# Altium schematic sheet BufferOpAmp.SchDoc
size A4; CompanyName: Technische Hochschule Nürnberg Georg Simon Ohm; Organization: UltraZohm; Address1: Kesslerplatz 12; Address2: 90489 Nürnberg; Address3: GERMANY; DocumentNumber: 6; SheetNumber: 6; SheetTotal: 12; Website: www.ultrazohm.com
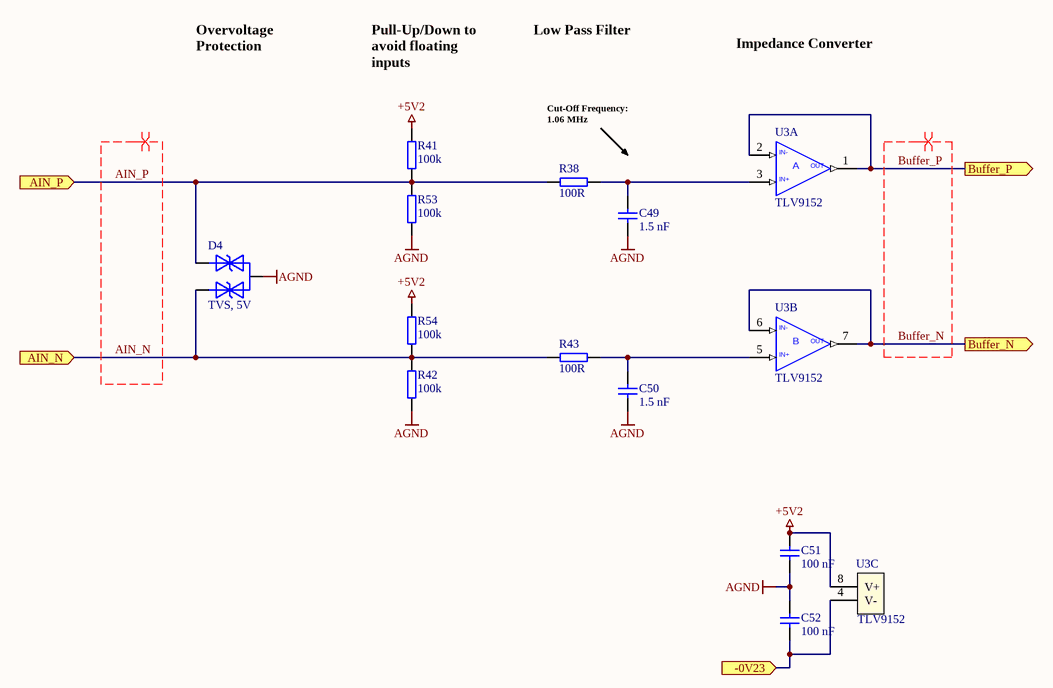
[diagram p0: BufferOpAmp.SchDoc]

## Parts
C49  1.5 nF  [C_0402_TE]
C50  1.5 nF  [C_0402_TE]
C51  100 nF  [C_0402_TE]
C52  100 nF  [C_0402_TE]
D4  TVS, 5V  [SOT-23-3]
R38  100R  [R_0402_TE]
R41  100k  [R_0402_TE]
R42  100k  [R_0402_TE]
R43  100R  [R_0402_TE]
R53  100k  [R_0402_TE]
R54  100k  [R_0402_TE]
U3  TLV9152  [MSOP-8_IPC_B]  (parts A,B,C of 3)

## Ports
-0V23 (in), AIN_N (in), AIN_P (in), Buffer_N (out), Buffer_P (out)

## Nets
+5V2: C51.1 R41.2 R54.2 U3.8(V+)
AGND: C49.1 C50.1 C51.2 C52.1 D4.3(A) R42.1 R53.1
-0V23: C52.2 U3.4(V-) ; port -0V23
AIN_N: D4.2(K2) R42.2 R43.1 R54.1 ; port AIN_N
AIN_P: D4.1(K1) R38.1 R41.1 R53.2 ; port AIN_P
Buffer_N: U3.6(-IN_B) U3.7(OUT_B) ; port Buffer_N
Buffer_P: U3.1(OUT_A) U3.2(-IN_A) ; port Buffer_P
NetC49_2: C49.2 R38.2 U3.3(+IN_A)
NetC50_2: C50.2 R43.2 U3.5(+IN_B)

## Layout directives
differential pair: AIN_N, AIN_P, Buffer_N, Buffer_P

## Notes on the sheet
- Overvoltage Protection
- Pull-Up/Down to avoid floating inputs
- Low Pass Filter
- Impedance Converter
- (near R38) Cut-Off Frequency:
  1.06 MHz
- Title
- Revision:
- Design Engineer:
- Date:
- Project:
- Sheet
- of
- (in symbol TLV9152IDGKR, part A) IN-; OUT; A; IN+
- (in symbol TLV9152IDGKR, part B) IN-; OUT; B; IN+

## Library data of the parts
C49 C50 = UZgen_C_0402_1.5nF_50V_NP0: Generic capacitor; Manufacturer: UZgen; Voltage: 50V; Tolerance: 10 %; Created from: UZgenTool; Manufacturer Part Number: UZgen_C_0402_1.5nF_50V_NP0; PartID: 5689; Created On: 13.12.2024 11:08:45; Value: 1.5 nF; Device Package: 0402; Technology: NP0; Mounting Type: SMD; Last Updated: 13.12.2024 11:08:45
C51 C52 = UZgen_C_0402_100nF_50V_X7R: Generic capacitor; Manufacturer: UZgen; Voltage: 50V; Tolerance: 10 %; Created from: UZgenTool; Manufacturer Part Number: UZgen_C_0402_100nF_50V_X7R; PartID: 3431; Created On: 02.08.2024 11:17:51; Value: 100 nF; Device Package: 0402; Technology: X7R; Mounting Type: SMD; Last Updated: 02.08.2024 11:17:51
D4 = SMC05: 2-Line Bi-directional TVS Diode Array; Manufacturer Part Number: SMC05; Manufacturer: Leditech; Type: TVS-Diode; Peak Impuls Current: 18 A; Power Dissipation: 300 W; Created from: AGeiger; PartID: 9; Created On: 30.08.2022 08:49:06; ComponentLink1Description: Datasheet; ComponentLink1URL: https://datasheet.lcsc.com/lcsc/1912111437_Leiditech-SMC05_C384879.pdf; Component Type: TVS Diode, ESD; Device Package: SOT-23-3; Last Updated: 30.08.2022 08:49:06; Mounting Type: SMD; Operating Temperature: -55 - 125°C; Series: SMC; Supplier 1: LCSC; Supplier Part Number 1: C384879; Value: TVS, 5V; Live Cycle Status: 1; LCSC Part Number: C384879
R38 R43 = UZgen_R_0402_100R: Generic resistor; Manufacturer: UZgen; Tolerance: 1 %; Created from: UZgenTool; Manufacturer Part Number: UZgen_R_0402_100R; PartID: 53; Created On: 02.07.2024 17:29:45; Value: 100R; Device Package: 0402; Mounting Type: SMD; Last Updated: 02.07.2024 17:29:45
R41 R42 R53 R54 = UZgen_R_0402_100k: Generic resistor; Manufacturer: UZgen; Tolerance: 1 %; Created from: UZgenTool; Manufacturer Part Number: UZgen_R_0402_100k; PartID: 125; Created On: 02.07.2024 17:29:47; Value: 100k; Device Package: 0402; Mounting Type: SMD; Last Updated: 02.07.2024 17:29:47
U3 = TLV9152IDGKR: Operationsverstärker Dual, 16-V, 4.5-MHz, low-power operational amplifier 8-VSSOP -40 to 125; Manufacturer: Texas Instruments; Channels: 2; GBP: 4.5 MHz; CMRR: 120 dB; Created from: AGeiger; Manufacturer Part Number: TLV9152IDGKR; PartID: 36; Created On: 15.11.2024 09:00:35; ComponentLink1Description: Datasheet; ComponentLink1URL: https://www.ti.com/lit/gpn/tlv9152; Component Type: Operational Amplifier; Device Package: MSOP-8; Last Updated: 15.11.2024 09:00:35; Mounting Type: SMD; Operating Temperature: -40 to +125 °C; Series: TLV915x; Supplier 1: Mouser; Supplier Part Number 1: 595-TLV9152IDGKR; Supplier 2: LCSC; Supplier Part Number 2: C4366107; Type: OpAmp; Value: TLV9152; Live Cycle Status: 1; LCSC Part Number: C4366107